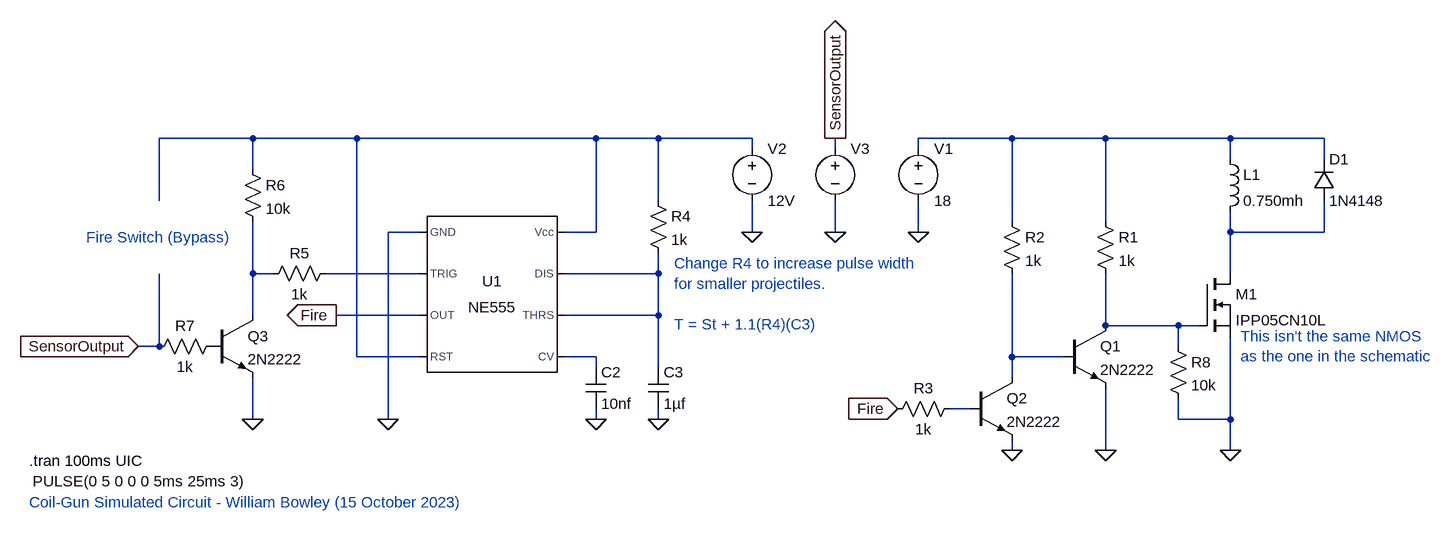
[diagram p0: schematic coil-gun-circuit.asc]
coil-gun-circuit.asc, the LTspice schematic file:
Version 4
SHEET 1 880 680
WIRE -1264 64 -1408 64
WIRE -1104 64 -1264 64
WIRE -736 64 -1104 64
WIRE -640 64 -736 64
WIRE -496 64 -640 64
WIRE -96 64 -240 64
WIRE 48 64 -96 64
WIRE 240 64 48 64
WIRE 384 64 240 64
WIRE -496 80 -496 64
WIRE -368 80 -368 64
WIRE -240 80 -240 64
WIRE 240 96 240 64
WIRE 384 96 384 64
WIRE -1264 112 -1264 64
WIRE -1408 160 -1408 64
WIRE -640 160 -640 64
WIRE -96 192 -96 64
WIRE 48 192 48 64
WIRE -1008 208 -1056 208
WIRE -736 208 -736 64
WIRE -736 208 -784 208
WIRE -496 208 -496 160
WIRE -368 208 -368 160
WIRE -240 208 -240 160
WIRE 240 208 240 176
WIRE 384 208 384 160
WIRE 384 208 240 208
WIRE -1264 272 -1264 192
WIRE -1232 272 -1264 272
WIRE -1008 272 -1152 272
WIRE -640 272 -640 240
WIRE -640 272 -784 272
WIRE 240 272 240 208
WIRE -1264 336 -1264 272
WIRE -1008 336 -1136 336
WIRE -640 336 -640 272
WIRE -640 336 -784 336
WIRE 48 352 48 272
WIRE 160 352 48 352
WIRE 192 352 160 352
WIRE -1408 384 -1408 272
WIRE -1408 384 -1440 384
WIRE 160 384 160 352
WIRE -1104 400 -1104 64
WIRE -1008 400 -1104 400
WIRE -736 400 -784 400
WIRE -96 400 -96 272
WIRE -16 400 -96 400
WIRE -736 416 -736 400
WIRE -640 416 -640 336
WIRE -96 432 -96 400
WIRE -160 480 -192 480
WIRE -1264 496 -1264 432
WIRE -1056 496 -1056 208
WIRE -736 496 -736 480
WIRE -640 496 -640 480
WIRE 160 496 160 464
WIRE 240 496 240 368
WIRE 240 496 160 496
WIRE -96 544 -96 528
WIRE 48 544 48 448
WIRE 240 544 240 496
FLAG 240 544 0
FLAG -240 208 0
FLAG 48 544 0
FLAG -96 544 0
FLAG -272 480 Fire
IOPIN -272 480 In
FLAG -1056 496 0
FLAG -1136 336 Fire
IOPIN -1136 336 Out
FLAG -736 496 0
FLAG -640 496 0
FLAG -496 208 0
FLAG -1264 496 0
FLAG -1440 384 SensorOutput
IOPIN -1440 384 In
FLAG -368 64 SensorOutput
IOPIN -368 64 Out
FLAG -368 208 0
SYMBOL ind 224 80 R0
SYMATTR InstName L1
SYMATTR Value 0.750mh
SYMATTR SpiceLine Rser=0.45
SYMBOL nmos 192 272 R0
SYMATTR InstName M1
SYMATTR Value IPP05CN10L
SYMBOL voltage -240 64 R0
WINDOW 123 0 0 Left 0
WINDOW 39 0 0 Left 0
SYMATTR InstName V1
SYMATTR Value 18
SYMBOL npn -16 352 R0
SYMATTR InstName Q1
SYMATTR Value 2N2222
SYMBOL npn -160 432 R0
SYMATTR InstName Q2
SYMATTR Value 2N2222
SYMBOL res 32 176 R0
SYMATTR InstName R1
SYMATTR Value 1k
SYMBOL res -112 176 R0
SYMATTR InstName R2
SYMATTR Value 1k
SYMBOL res -176 464 R90
WINDOW 0 0 56 VBottom 2
WINDOW 3 32 56 VTop 2
SYMATTR InstName R3
SYMATTR Value 1k
SYMBOL Misc\\NE555 -896 304 R0
SYMATTR InstName U1
SYMBOL cap -752 416 R0
SYMATTR InstName C2
SYMATTR Value 10nf
SYMBOL cap -656 416 R0
SYMATTR InstName C3
SYMATTR Value 1µf
SYMBOL res -656 144 R0
SYMATTR InstName R4
SYMATTR Value 1k
SYMBOL voltage -496 64 R0
WINDOW 123 0 0 Left 0
WINDOW 39 0 0 Left 0
SYMATTR InstName V2
SYMATTR Value 12V
SYMBOL res -1136 256 R90
WINDOW 0 0 56 VBottom 2
WINDOW 3 32 56 VTop 2
SYMATTR InstName R5
SYMATTR Value 1k
SYMBOL res -1280 96 R0
SYMATTR InstName R6
SYMATTR Value 10k
SYMBOL npn -1328 336 R0
SYMATTR InstName Q3
SYMATTR Value 2N2222
SYMBOL res -1312 368 R90
WINDOW 0 0 56 VBottom 2
WINDOW 3 32 56 VTop 2
SYMATTR InstName R7
SYMATTR Value 1k
SYMBOL voltage -368 64 R0
WINDOW 3 -1235 527 Left 2
WINDOW 123 0 0 Left 0
WINDOW 39 0 0 Left 0
SYMATTR Value PULSE(0 5 0 0 0 5ms 25ms 3)
SYMATTR InstName V3
SYMBOL diode 368 160 M180
WINDOW 0 24 64 Left 2
WINDOW 3 24 0 Left 2
SYMATTR InstName D1
SYMATTR Value 1N4148
SYMBOL res 144 368 R0
SYMATTR InstName R8
SYMATTR Value 10k
TEXT 256 368 Left 2 ;This isn't the same NMOS\nas the one in the schematic
TEXT -1520 216 Left 2 ;Fire Switch (Bypass)
TEXT -1608 624 Left 2 ;Coil-Gun Simulated Circuit - William Bowley (15 October 2023)
TEXT -1608 560 Left 2 !.tran 100ms UIC
TEXT -616 256 Left 2 ;Change R4 to increase pulse width \nfor smaller projectiles.\n \nT = St + 1.1(R4)(C3)

The netlist it stands for:
* coil-gun-circuit.asc
L1 N002 N003 0.750mh Rser=0.45
M1 N003 N007 0 0 IPP05CN10L
V1 N002 0 18
Q1 N007 N009 0 0 2N2222
Q2 N009 N010 0 0 2N2222
R1 N002 N007 1k
R2 N002 N009 1k
R3 N010 Fire 1k
XU1 0 N005 Fire N001 N008 N006 N006 N001 NE555  ; pins GND TRIG OUT RST CV THRS DIS Vcc
C2 N008 0 10nf
C3 N006 0 1µf
R4 N001 N006 1k
V2 N001 0 12V
R5 N005 N004 1k
R6 N001 N004 10k
Q3 N004 P001 0 0 2N2222
R7 P001 SensorOutput 1k
V3 SensorOutput 0 PULSE(0 5 0 0 0 5ms 25ms 3)
D1 N003 N002 1N4148
R8 N007 0 10k
.model D D
.lib standard.dio
.model NPN NPN
.model PNP PNP
.lib standard.bjt
.model NMOS NMOS
.model PMOS PMOS
.lib standard.mos
* This isn't the same NMOS
* as the one in the schematic
* Fire Switch (Bypass)
* Coil-Gun Simulated Circuit - William Bowley (15 October 2023)
.tran 100ms UIC
* Change R4 to increase pulse width
* for smaller projectiles.
* T = St + 1.1(R4)(C3)
.lib NE555.sub
.backanno
.end